# Altium schematic sheet MCU.SchDoc: MCU
size A4; Date: Not used; ApprovedBy: Not used; CheckedBy: Not used; Author: Not used; CompanyName: STMicroelectronics; DrawnBy: Not used; Engineer: Not used; Organization: Not used; Address1: Not used; Address2: Not used; Address3: Not used; Address4: Not used; DocumentNumber: Not used; Revision: Not used; SheetNumber: 3; SheetTotal: 6; CurrentTime: Not used; CurrentDate: Not used; Time: Not used; DocumentFullPathAndName: Not used; DocumentName: Not used; ModifiedDate: Not used; ImagePath: Not used; ProjectName: Not used; Application_BuildNumber: Not used
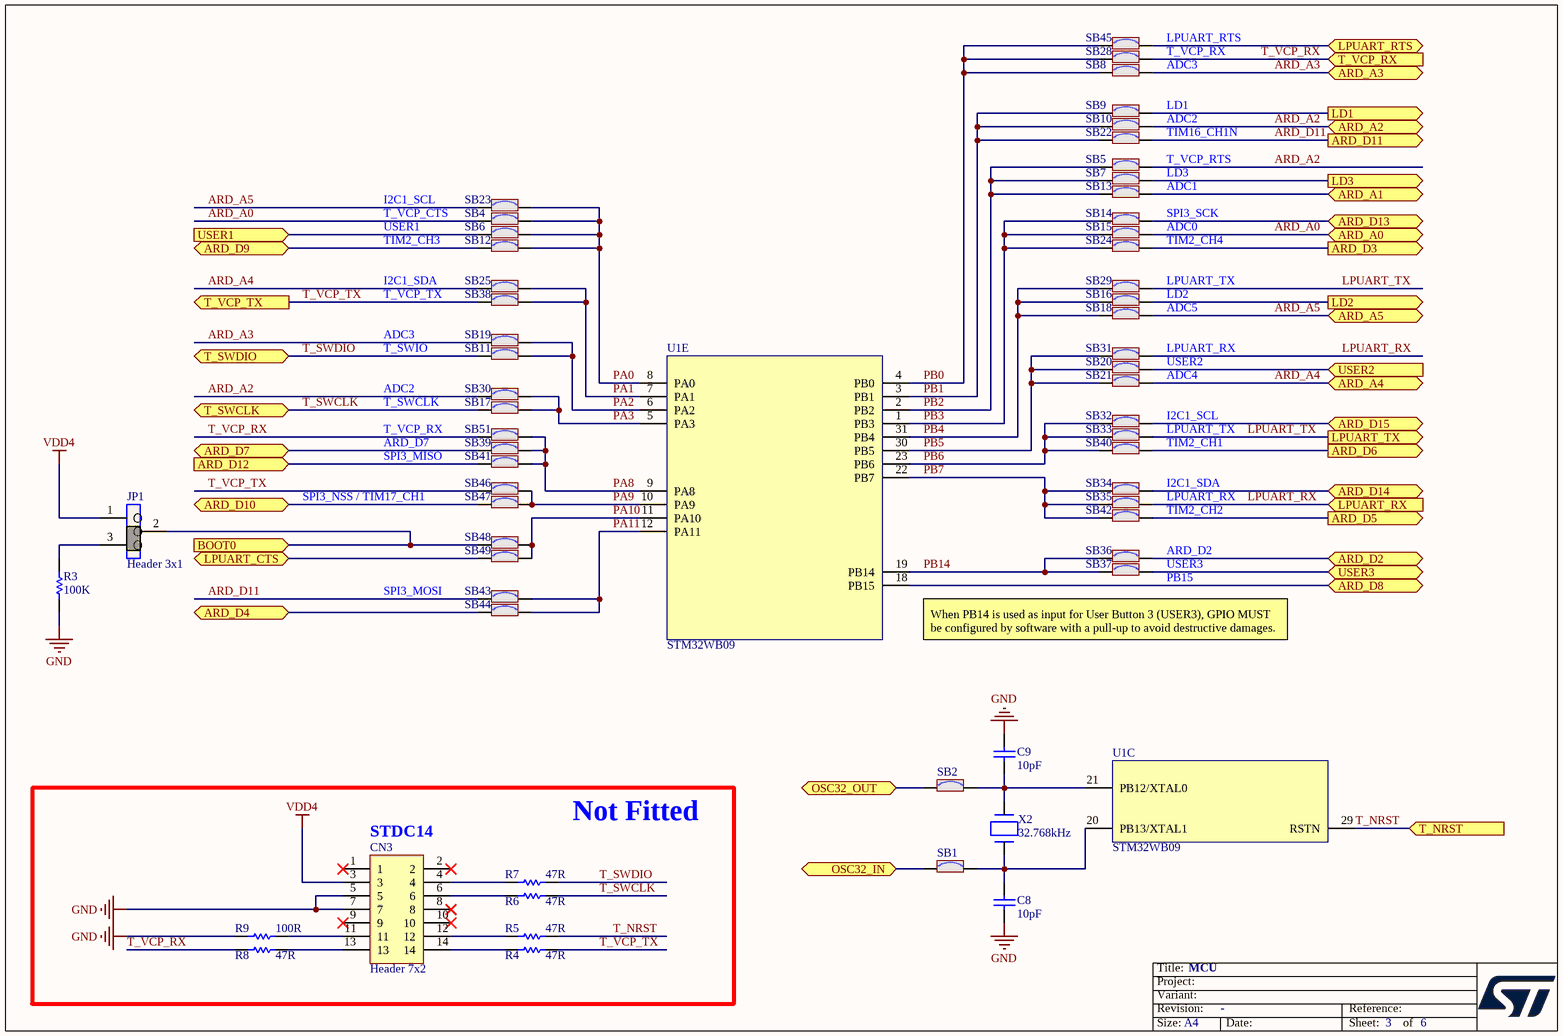
[diagram p0: MCU.SchDoc]

## Parts
C8  value 10pF  [C0402]  (hidden comment: Capacitor)
C9  value 10pF  [C0402]  (hidden comment: Capacitor)
CN3  Header 7x2  [CON_SAMTEC_FTSH-107-01-L-DV-K]
JP1  value Header 3x1  [CON_SAMTEC_TSW-103-07-F-S]  (hidden comment: Jumper_Header 3x1 Fitted 2-3)
R3  value 100K  [R0402]  (hidden comment: Resistor)
R4  value 47R  [R0402]  (hidden comment: Resistor)
R5  value 47R  [R0402]  (hidden comment: Resistor)
R6  value 47R  [R0402]  (hidden comment: Resistor)
R7  value 47R  [R0402]  (hidden comment: Resistor)
R8  value 47R  [R0402]  (hidden comment: Resistor)
R9  value 100R  [R0402]  (hidden comment: Resistor)
SB1  SB_ON  [SOLDER-BRIDGE_R0402-0R]  (value not drawn)
SB2  SB_ON  [SOLDER-BRIDGE_R0402-0R]  (value not drawn)
SB4  SB_ON  [SOLDER-BRIDGE_R0402-0R]  (value not drawn)
SB5  SB_ON  [SOLDER-BRIDGE_R0402-0R]  (value not drawn)
SB6  SB_ON  [SOLDER-BRIDGE_R0402-0R]  (value not drawn)
SB7  SB_ON  [SOLDER-BRIDGE_R0402-0R]  (value not drawn)
SB8  SB_ON  [SOLDER-BRIDGE_R0402-0R]  (value not drawn)
SB9  SB_ON  [SOLDER-BRIDGE_R0402-0R]  (value not drawn)
SB10  SB_ON  [SOLDER-BRIDGE_R0402-0R]  (value not drawn)
SB11  SB_ON  [SOLDER-BRIDGE_R0402-0R]  (value not drawn)
SB12  SB_ON  [SOLDER-BRIDGE_R0402-0R]  (value not drawn)
SB13  SB_ON  [SOLDER-BRIDGE_R0402-0R]  (value not drawn)
SB14  SB_ON  [SOLDER-BRIDGE_R0402-0R]  (value not drawn)
SB15  SB_ON  [SOLDER-BRIDGE_R0402-0R]  (value not drawn)
SB16  SB_ON  [SOLDER-BRIDGE_R0402-0R]  (value not drawn)
SB17  SB_ON  [SOLDER-BRIDGE_R0402-0R]  (value not drawn)
SB18  SB_ON  [SOLDER-BRIDGE_R0402-0R]  (value not drawn)
SB19  SB_ON  [SOLDER-BRIDGE_R0402-0R]  (value not drawn)
SB20  SB_ON  [SOLDER-BRIDGE_R0402-0R]  (value not drawn)
SB21  SB_ON  [SOLDER-BRIDGE_R0402-0R]  (value not drawn)
SB22  SB_ON  [SOLDER-BRIDGE_R0402-0R]  (value not drawn)
SB23  SB_ON  [SOLDER-BRIDGE_R0402-0R]  (value not drawn)
SB24  SB_ON  [SOLDER-BRIDGE_R0402-0R]  (value not drawn)
SB25  SB_ON  [SOLDER-BRIDGE_R0402-0R]  (value not drawn)
SB28  SB_ON  [SOLDER-BRIDGE_R0402-0R]  (value not drawn)
SB29  SB_ON  [SOLDER-BRIDGE_R0402-0R]  (value not drawn)
SB30  SB_ON  [SOLDER-BRIDGE_R0402-0R]  (value not drawn)
SB31  SB_ON  [SOLDER-BRIDGE_R0402-0R]  (value not drawn)
SB32  SB_ON  [SOLDER-BRIDGE_R0402-0R]  (value not drawn)
SB33  SB_ON  [SOLDER-BRIDGE_R0402-0R]  (value not drawn)
SB34  SB_ON  [SOLDER-BRIDGE_R0402-0R]  (value not drawn)
SB35  SB_ON  [SOLDER-BRIDGE_R0402-0R]  (value not drawn)
SB36  SB_ON  [SOLDER-BRIDGE_R0402-0R]  (value not drawn)
SB37  SB_ON  [SOLDER-BRIDGE_R0402-0R]  (value not drawn)
SB38  SB_ON  [SOLDER-BRIDGE_R0402-0R]  (value not drawn)
SB39  SB_ON  [SOLDER-BRIDGE_R0402-0R]  (value not drawn)
SB40  SB_ON  [SOLDER-BRIDGE_R0402-0R]  (value not drawn)
SB41  SB_ON  [SOLDER-BRIDGE_R0402-0R]  (value not drawn)
SB42  SB_ON  [SOLDER-BRIDGE_R0402-0R]  (value not drawn)
SB43  SB_ON  [SOLDER-BRIDGE_R0402-0R]  (value not drawn)
SB44  SB_ON  [SOLDER-BRIDGE_R0402-0R]  (value not drawn)
SB45  SB_ON  [SOLDER-BRIDGE_R0402-0R]  (value not drawn)
SB46  SB_ON  [SOLDER-BRIDGE_R0402-0R]  (value not drawn)
SB47  SB_ON  [SOLDER-BRIDGE_R0402-0R]  (value not drawn)
SB48  SB_ON  [SOLDER-BRIDGE_R0402-0R]  (value not drawn)
SB49  SB_ON  [SOLDER-BRIDGE_R0402-0R]  (value not drawn)
SB51  SB_ON  [SOLDER-BRIDGE_R0402-0R]  (value not drawn)
U1  STM32WB09  [ICC_QFN32-EPAD_5X5_P050]  (parts C,E of 5)
X2  value 32.768kHz  [CRY_NX2012SA_2P]  (hidden comment: XTAL_2_PINS)

## Blocks framed on the sheet
Not Fitted: CN3 R4-R9

## Ports
ARD_A0 (bidir), ARD_A1 (bidir), ARD_A2 (bidir), ARD_A3 (bidir), ARD_A4 (bidir), ARD_A5 (bidir), ARD_D2 (bidir), ARD_D3 (out), ARD_D4 (bidir), ARD_D5 (out), ARD_D6 (out), ARD_D7 (bidir), ARD_D8 (bidir), ARD_D9 (bidir), ARD_D10 (bidir), ARD_D11 (out), ARD_D12 (in), ARD_D13 (bidir), ARD_D14 (bidir), ARD_D15 (bidir), BOOT0 (in), LD1 (out), LD2 (out), LD3 (out), LPUART_CTS (bidir), LPUART_RTS (bidir), LPUART_RX (in), LPUART_TX (out), OSC32_IN (bidir), OSC32_OUT (bidir), T_NRST (in), T_SWCLK (bidir), T_SWDIO (bidir), T_VCP_RX (in), T_VCP_TX (out), USER1 (in), USER2 (in), USER3 (bidir)

## Nets
GND: C8.1 C9.2 CN3.5 CN3.7 R3.1 R9.1
VDD4: CN3.3 JP1.1
ARD_A0: SB4.1 SB15.2 ; port ARD_A0
ARD_A1: SB13.2 ; port ARD_A1
ARD_A2: SB5.2 SB10.2 SB30.1 ; port ARD_A2
ARD_A3: SB8.2 SB19.1 ; port ARD_A3
ARD_A4: SB21.2 SB25.1 ; port ARD_A4
ARD_A5: SB18.2 SB23.1 ; port ARD_A5
ARD_D2: SB36.2 ; port ARD_D2
ARD_D3: SB24.2 ; port ARD_D3
ARD_D4: SB44.1 ; port ARD_D4
ARD_D5: SB42.2 ; port ARD_D5
ARD_D6: SB40.2 ; port ARD_D6
ARD_D7: SB39.1 ; port ARD_D7
ARD_D8: U1.18(PB15) ; port ARD_D8
ARD_D9: SB12.1 ; port ARD_D9
ARD_D10: SB47.1 ; port ARD_D10
ARD_D11: SB22.2 SB43.1 ; port ARD_D11
ARD_D12: SB41.1 ; port ARD_D12
ARD_D13: SB14.2 ; port ARD_D13
ARD_D14: SB34.2 ; port ARD_D14
ARD_D15: SB32.2 ; port ARD_D15
BOOT0: JP1.2 SB48.1 ; port BOOT0
LD1: SB9.2 ; port LD1
LD2: SB16.2 ; port LD2
LD3: SB7.2 ; port LD3
LPUART_CTS: SB49.1 ; port LPUART_CTS
LPUART_RTS: SB45.2 ; port LPUART_RTS
LPUART_RX: SB31.2 SB35.2 ; port LPUART_RX
LPUART_TX: SB29.2 SB33.2 ; port LPUART_TX
OSC32_IN: SB1.1 ; port OSC32_IN
OSC32_OUT: SB2.1 ; port OSC32_OUT
PA0: SB4.2 SB6.2 SB12.2 SB23.2 U1.8(PA0)
PA1: SB25.2 SB38.2 U1.7(PA1)
PA2: SB11.2 SB19.2 U1.6(PA2)
PA3: SB17.2 SB30.2 U1.5(PA3)
PA8: SB39.2 SB41.2 SB51.1 U1.9(PA8)
PA9: SB46.2 SB47.2 U1.10(PA9)
PA10: SB48.2 SB49.2 U1.11(PA10)
PA11: SB43.2 SB44.2 U1.12(PA11)
PB0: SB8.1 SB28.1 SB45.1 U1.4(PB0)
PB1: SB9.1 SB10.1 SB22.1 U1.3(PB1)
PB2: SB5.1 SB7.1 SB13.1 U1.2(PB2)
PB3: SB14.1 SB15.1 SB24.1 U1.1(PB3)
PB4: SB16.1 SB18.1 SB29.1 U1.31(PB4)
PB5: SB20.1 SB21.1 SB31.1 U1.30(PB5)
PB6: SB32.1 SB33.1 SB40.1 U1.23(PB6)
PB7: SB34.1 SB35.1 SB42.1 U1.22(PB7)
PB14: SB36.1 SB37.1 U1.19(PB14)
T_NRST: R5.2 U1.29(RSTN) ; port T_NRST
T_SWCLK: R6.2 SB17.1 ; port T_SWCLK
T_SWDIO: R7.2 SB11.1 ; port T_SWDIO
T_VCP_RX: R8.1 SB28.2 SB51.2 ; port T_VCP_RX
T_VCP_TX: R4.2 SB38.1 SB46.1 ; port T_VCP_TX
USER1: SB6.1 ; port USER1
USER2: SB20.2 ; port USER2
USER3: SB37.2 ; port USER3
NetC8_2: C8.2 SB1.2 U1.20(PB13/XTAL1) X2.2(X2)
NetC9_1: C9.1 SB2.2 U1.21(PB12/XTAL0) X2.1(X1)
NetCN3_4: CN3.4 R7.1
NetCN3_6: CN3.6 R6.1
NetCN3_11: CN3.11 R9.2
NetCN3_12: CN3.12 R5.1
NetCN3_13: CN3.13 R8.2
NetCN3_14: CN3.14 R4.1
NetJP1_3: JP1.3 R3.2

Not connected (* = marked no-connect by the designer): CN3 1* 2* 8* 9* 10*

## Notes on the sheet
- LPUART_RTS
- ADC3
- T_VCP_RX
- LD1
- ADC2
- LD3
- TIM16_CH1N
- T_VCP_RTS
- TIM2_CH3
- T_VCP_CTS
- I2C1_SCL
- USER1
- ADC0
- ADC1
- TIM2_CH4
- SPI3_SCK
- I2C1_SDA
- T_VCP_TX
- ADC5
- LD2
- LPUART_TX
- T_SWIO
- ADC4
- LPUART_RX
- USER2
- T_SWCLK
- ARD_D7
- TIM2_CH1
- SPI3_NSS / TIM17_CH1
- SPI3_MISO
- TIM2_CH2
- ARD_D2
- USER3
- PB15
- SPI3_MOSI
- When PB14 is used as input for User Button 3 (USER3), GPIO MUST be configured by software with a pull-up to avoid destructive damages.
- (near CN3) STDC14
- Title:
- Project:
- Size:
- Revision:
- Variant:
- A4
- -
- Date:
- Reference:
- Sheet:
- of

## Library data of the parts
C8 C9 = MCD-00015: Capacitor, MLCC, 10pF, 50V, NPO, +/-5%, 0402, T=0.5mm; Part_Preference: Recommended; Manufacturer: YAGEO; Manufacturer_Part_Number: CC0402JRNPO9BN100; Order_Code_RS: 3019160RL; Component_Country_Of_Origin: China; ShowFields: YES; ID: 2465; Internal_Part_Number: MCD-00015; Status: Released; Part_Type: Capacitor; Package: 0402; ComponentLink1URL: http://tunmcdsvn.tun.st.com/Component_Documentation_Library/Trunk/Capacitor/YAGEO_NP0_Series; Order_Code_Digikey: 311-1014-1-ND; Order_Code_Farnell: 3019160RL
CN3 = MCD-01531: Header, 7x2, 1.27mm, VR, T=5.97mm, FTSH series STDC14 without Alignment Pin; Part_Type: Connector; Part_Preference: Recommended; Manufacturer: SAMTEC; Manufacturer_Part_Number: FTSH-107-01-L-DV-K; Order_Code_RS: 179-9021; Component_Country_Of_Origin: China, Costa Rica, Malaysia, United States, Vietnam; ShowFields: YES; ID: 3631; Internal_Part_Number: MCD-01531; Value: Header 7x2; Status: Checked; ComponentLink1URL: http://tunmcdsvn.tun.st.com/Component_Documentation_Library/Trunk/Connector/SAMTEC_FTSH_Series/; Order_Code_Digikey: SAM9449-ND; Order_Code_Farnell: 2856443
JP1 = MCD-00685: Header, 3x1, 2.54mm, VR, TH, T=5.84mm/2.54mm; Part_Type: Connector; Part_Preference: Recommended; Manufacturer: SAMTEC; Manufacturer_Part_Number: TSW-103-07-F-S; Order_Code_RS: 161-2248; Component_Country_Of_Origin: China, Costa Rica, Malaysia, United States, Vietnam; ShowFields: YES; ID: 3058; Internal_Part_Number: MCD-00685; Status: Released; ComponentLink1URL: http://tunmcdsvn.tun.st.com/Component_Documentation_Library/Trunk/Connector/SAMTEC_TSW_Series/; Order_Code_Digikey: SAM8995-ND; Order_Code_Farnell: 2505043
R3 = MCD-00059: Resistor, 100K, 0402, +/-1%, 1/16W; Part_Preference: Recommended; Manufacturer: YAGEO; Manufacturer_Part_Number: RC0402FR-07100KL; Partial_Alternate_Internal_Part_Number: MCD-03301; Order_Code_RS: 2421891; Component_Country_Of_Origin: China; ShowFields: YES; ID: 2533; Internal_Part_Number: MCD-00059; Status: Released; Part_Type: Resistor; Package: 0402; ComponentLink1URL: http://tunmcdsvn.tun.st.com/Component_Documentation_Library/Trunk/Resistor/YAGEO_RC_L_Series; Order_Code_Digikey: 311-100KLRTR-ND; Order_Code_Farnell: 2421891
R4-R8 = MCD-00481: Resistor, 47R, 0402, +/-1%, 1/16W; Part_Preference: Recommended; Manufacturer: YAGEO; Manufacturer_Part_Number: RC0402FR-0747RL; Component_Country_Of_Origin: China; ShowFields: YES; ID: 2796; Internal_Part_Number: MCD-00481; Status: Released; Part_Type: Resistor; Package: 0402; ComponentLink1URL: http://tunmcdsvn.tun.st.com/Component_Documentation_Library/Trunk/Resistor/YAGEO_RC_L_Series; Order_Code_Digikey: 311-47.0LRCT-ND; Order_Code_Farnell: 9239073; Order_Code_RS: N/A
R9 = MCD-00067: Resistor, 100R, 0402, +/- 1%, 1/16W; Part_Preference: Recommended; Manufacturer: YAGEO; Manufacturer_Part_Number: RC0402FR-07100RL; Order_Code_RS: 9239111; Component_Country_Of_Origin: China; ShowFields: YES; ID: 2527; Internal_Part_Number: MCD-00067; Status: Released; Part_Type: Resistor; Package: 0402; ComponentLink1URL: http://tunmcdsvn.tun.st.com/Component_Documentation_Library/Trunk/Resistor/YAGEO_RC_L_Series; Order_Code_Digikey: 311-100LRCT-ND; Order_Code_Farnell: 9239111
SB1 SB2 SB4-SB25 SB28-SB49 SB51 = MCD-01618: Solder Bridge 0402 ON; Part_Type: Resistor; Part_Preference: Recommended; Manufacturer: YAGEO; Manufacturer_Part_Number: RC0402JR-070RL; Value: 0R; Order_Code_RS: 618-5804; Component_Country_Of_Origin: China; ShowFields: YES; ID: 3718; Internal_Part_Number: MCD-01618; Status: Released; Package: 0402; ComponentLink1URL: http://tunmcdsvn.tun.st.com/Component_Documentation_Library/Trunk/Resistor/YAGEO_RC0402_Series; Order_Code_Digikey: 311-0.0JRTR-ND; Order_Code_Farnell: 2363467
U1 = MCD-03444: Bluetooth® Low Energy wireless SoC; Part_Type: IC; Part_Preference: Recommended; Manufacturer: STMICROELECTRONICS; Component_Country_Of_Origin: Unknown; ShowFields: YES; ID: 5560; Internal_Part_Number: MCD-03444; Value: STM32WB09; Status: Checked; Manufacturer_Part_Number: STM32WB09; Package: QFN32; ComponentLink1URL: http://tunmcdsvn.tun.st.com/Component_Documentation_Library/Trunk/IC/STMICROELECTRONICS_BLUENRG-372AC; Order_Code_Digikey: N/A; Order_Code_Farnell: N/A; Order_Code_RS: N/A
X2 = MCD-01445: Crystal, 32.768kHz, 7pF, +/-20ppm, 80K, 2.05x1.2mm; BMS_Part_Number: 9157043; Part_Type: Crystal_Osc; Part_Preference: Recommended; Manufacturer: NDK; Manufacturer_Part_Number: NX2012SA-32.768KHZ-EXS00A-MU00389; Component_Country_Of_Origin: Unknown; ShowFields: YES; ID: 3545; Internal_Part_Number: MCD-01445; Status: Checked; Package: 2.05x1.2mm; ComponentLink1URL: http://tunmcdsvn.tun.st.com/Component_Documentation_Library/Trunk/Crytal_Oscillator/NDK_NX2012SA_Series; Order_Code_Digikey: 644-1350; Order_Code_Farnell: N/A; Order_Code_RS: N/A